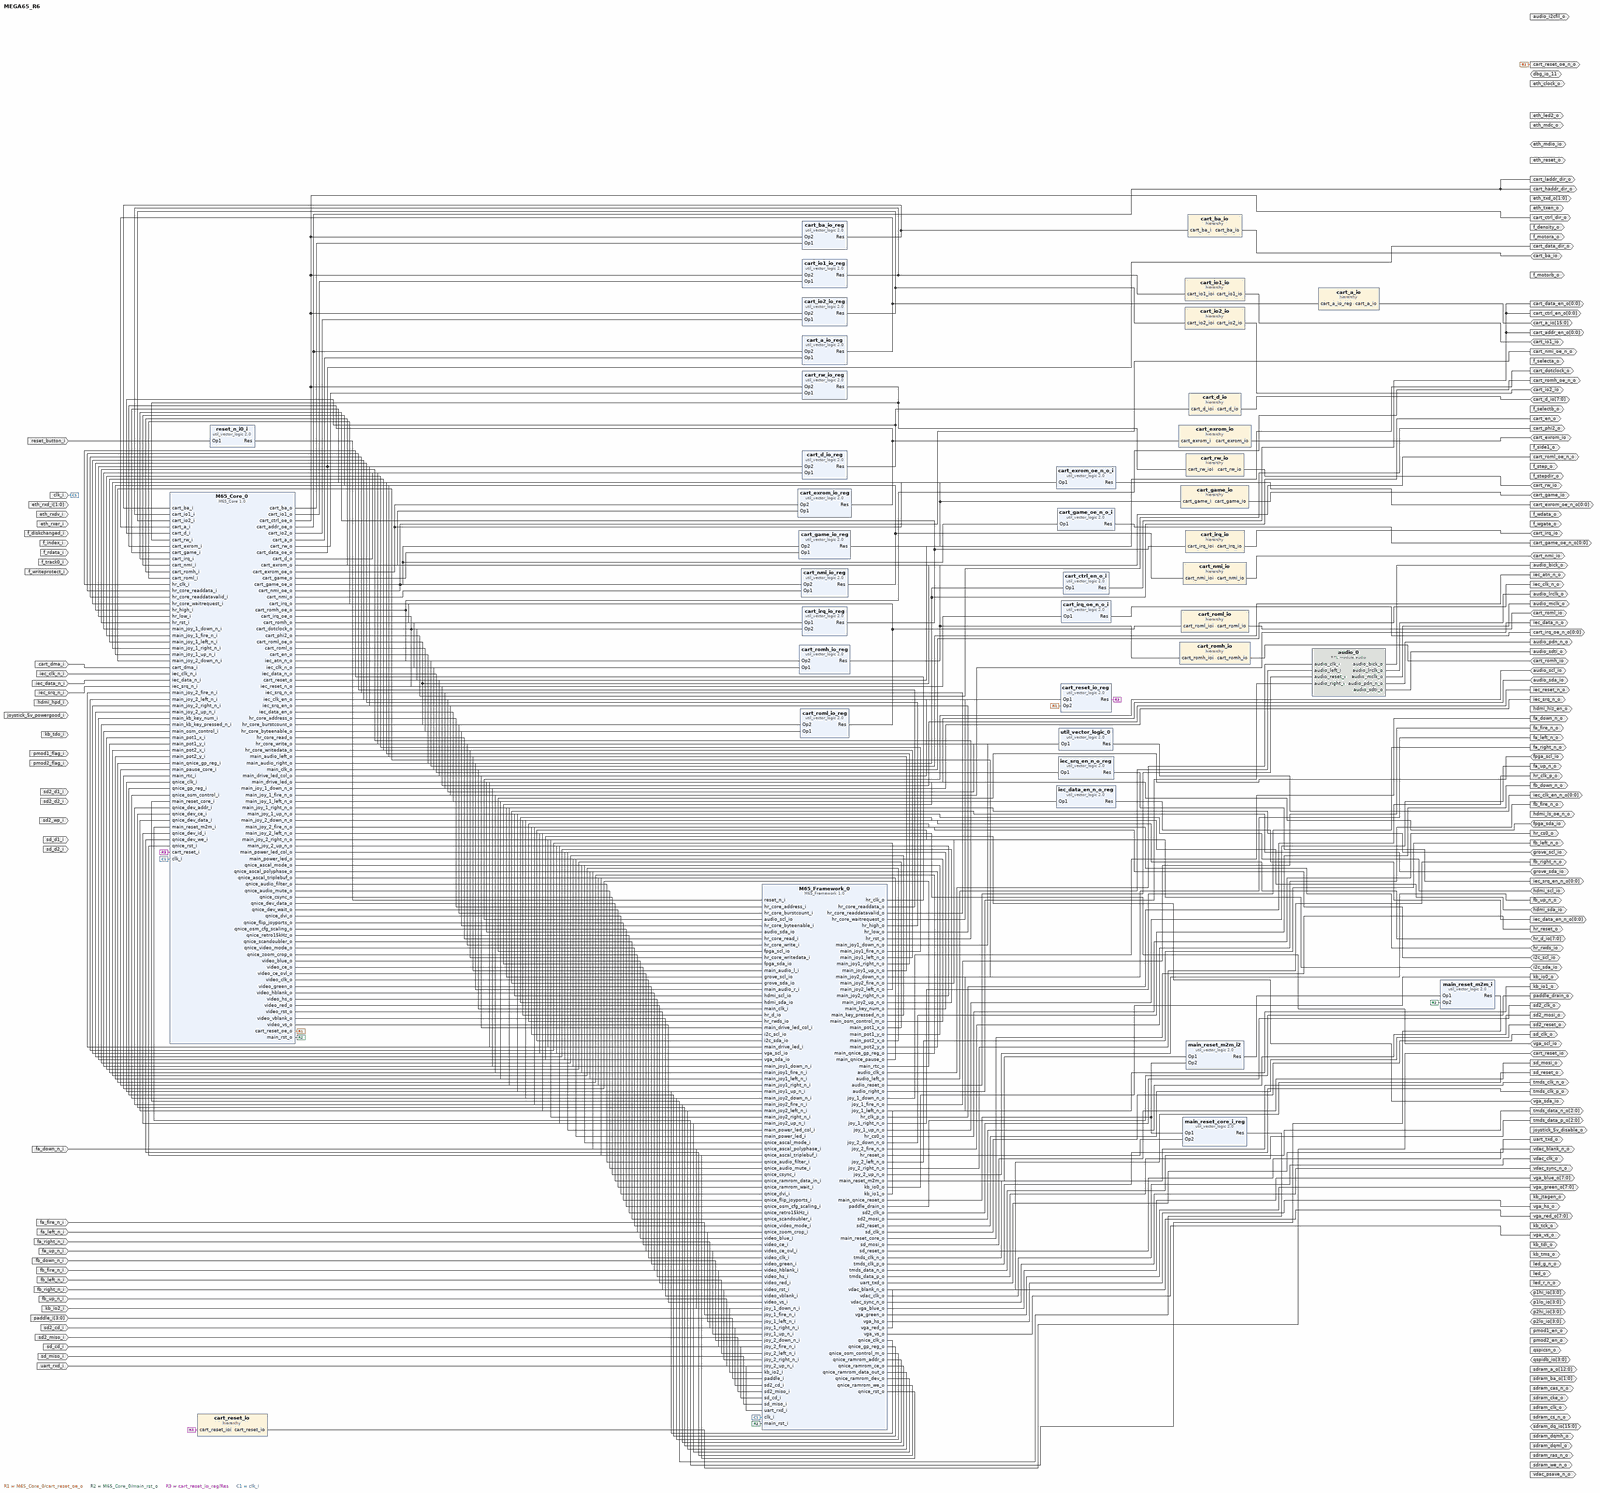
[diagram p0: block diagram of the top level, whole]
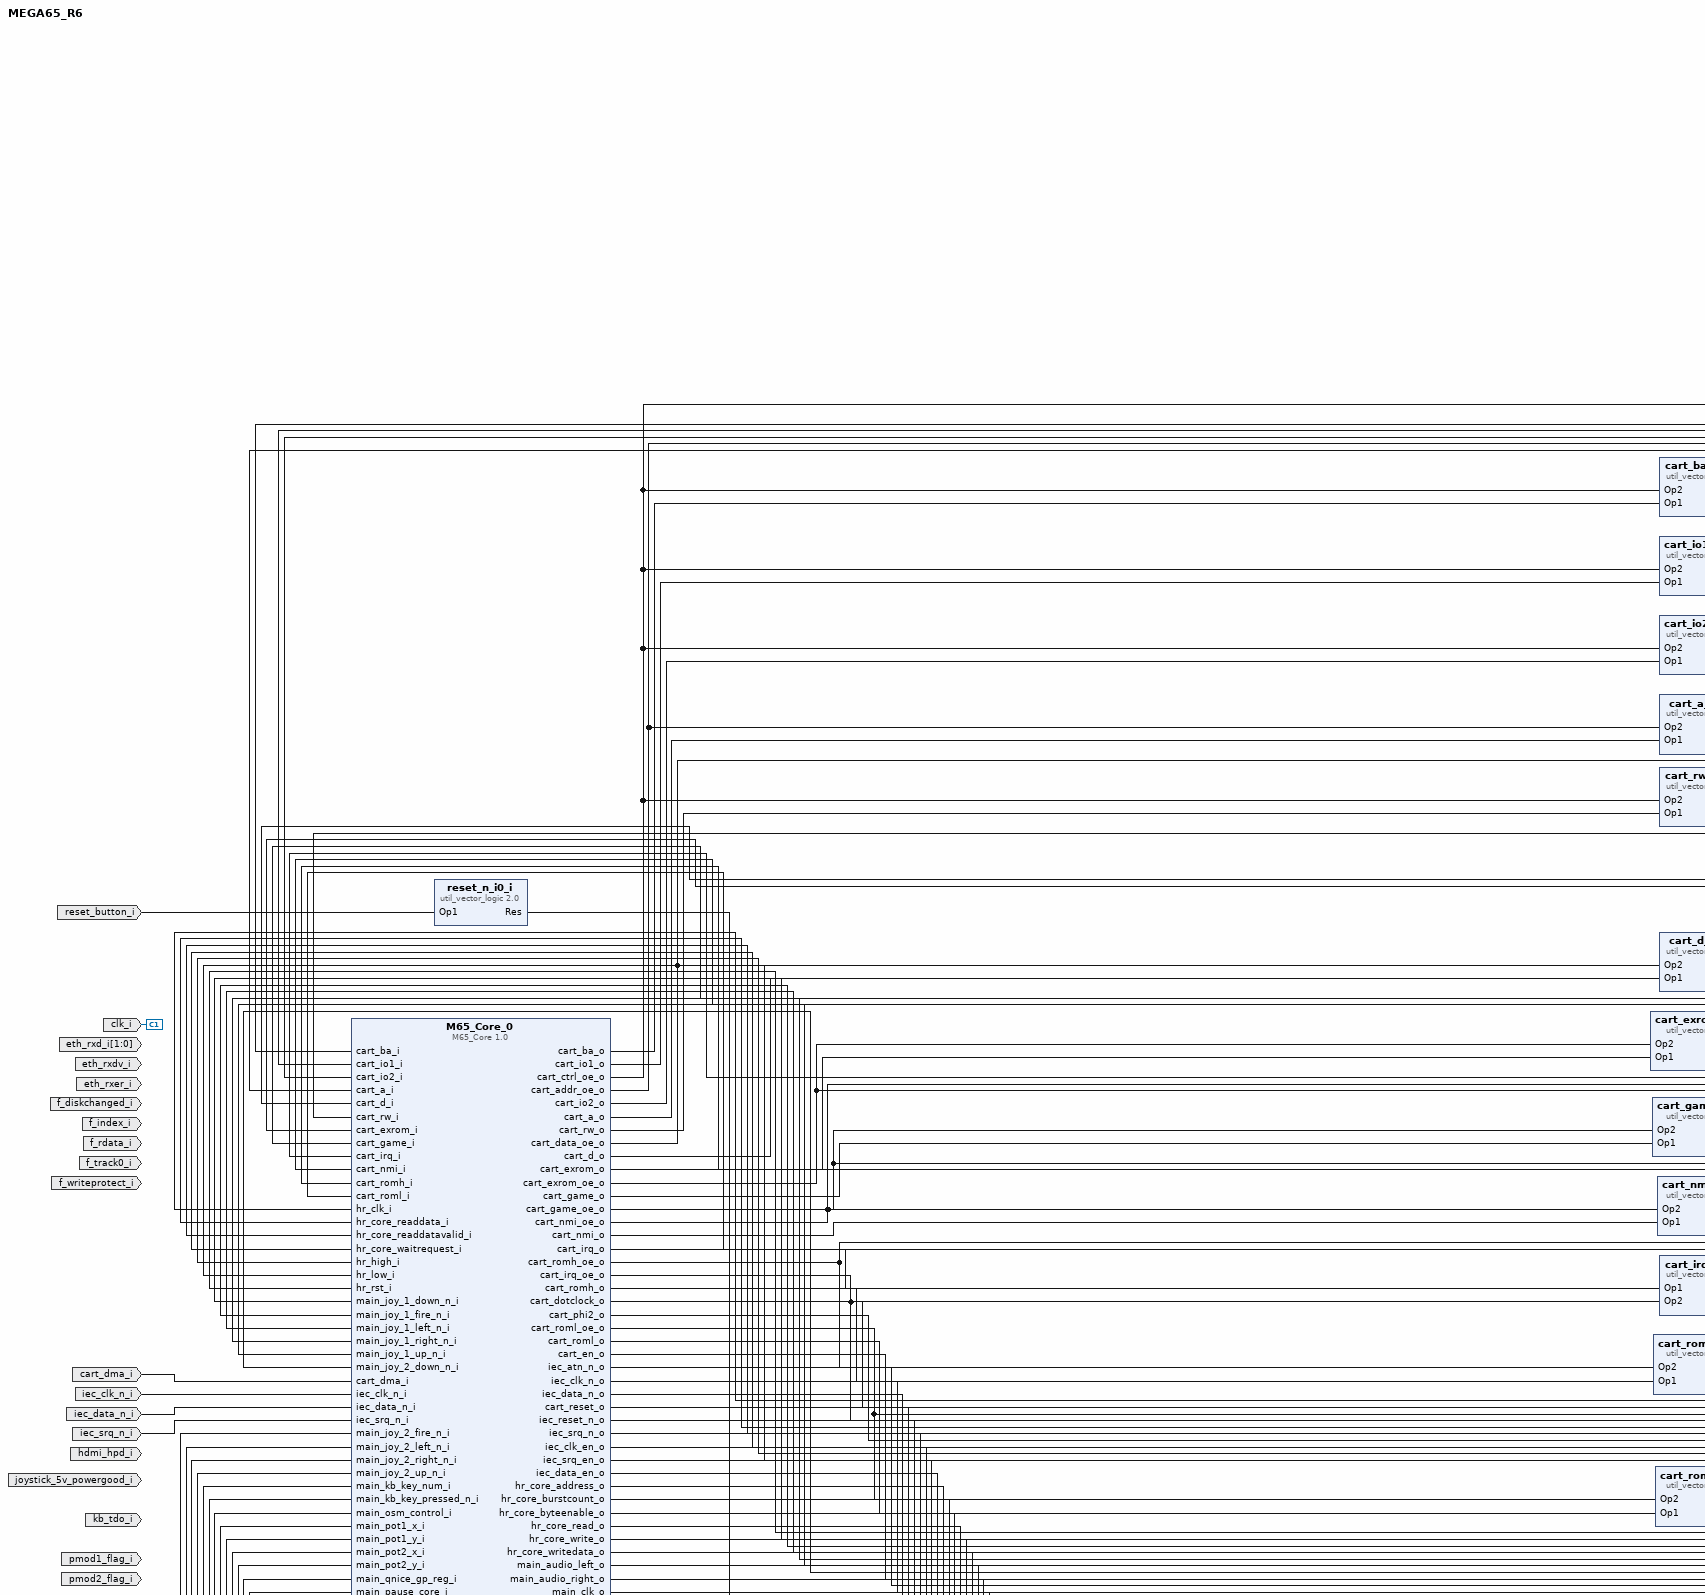
[diagram p1: block diagram of the top level, upper left part]
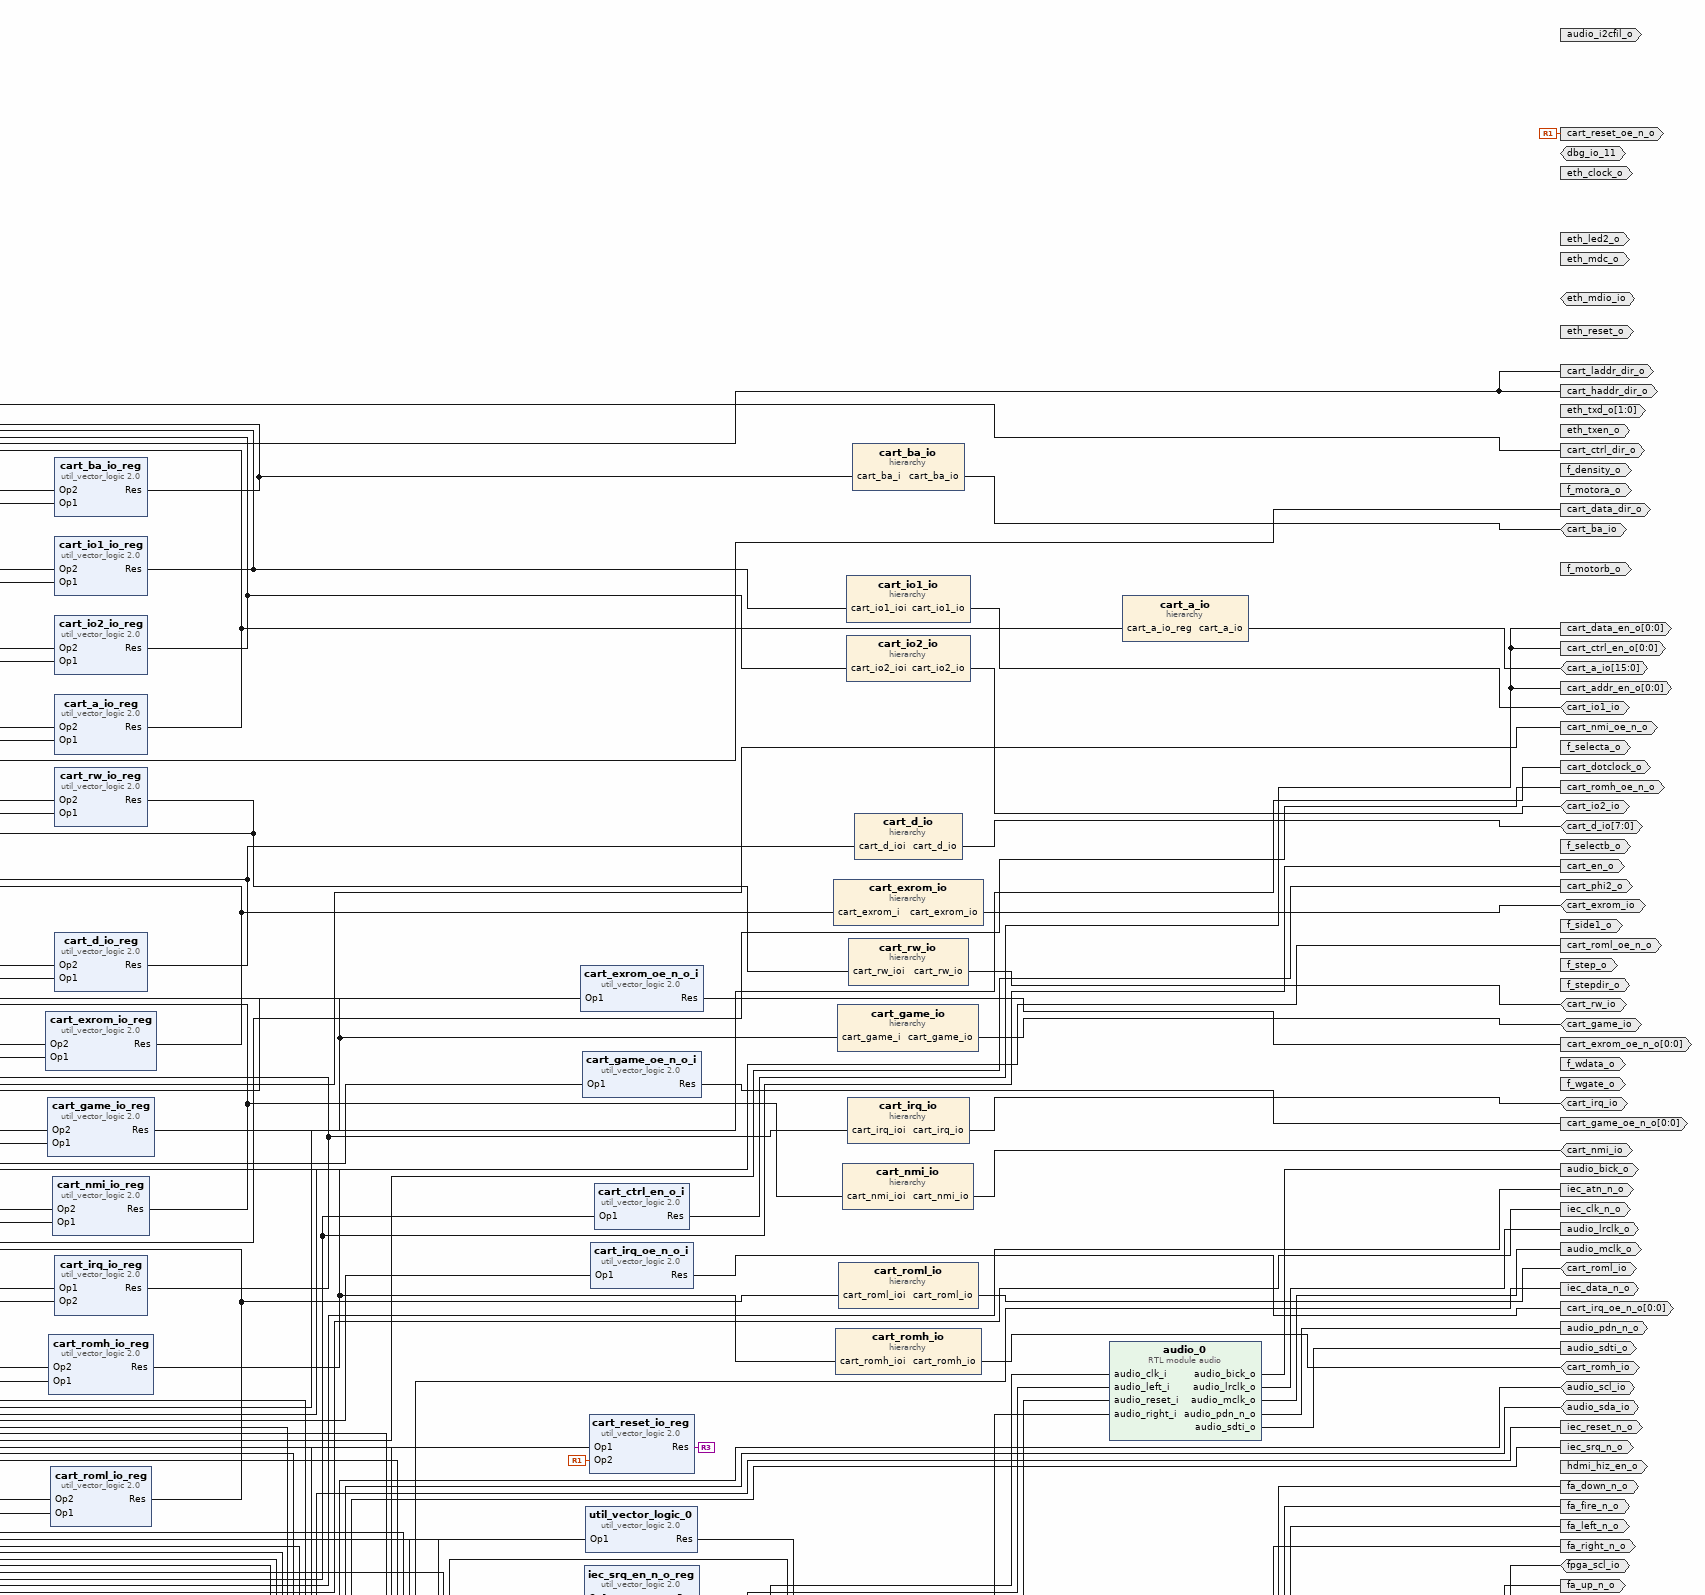
[diagram p2: block diagram of the top level, upper right part]
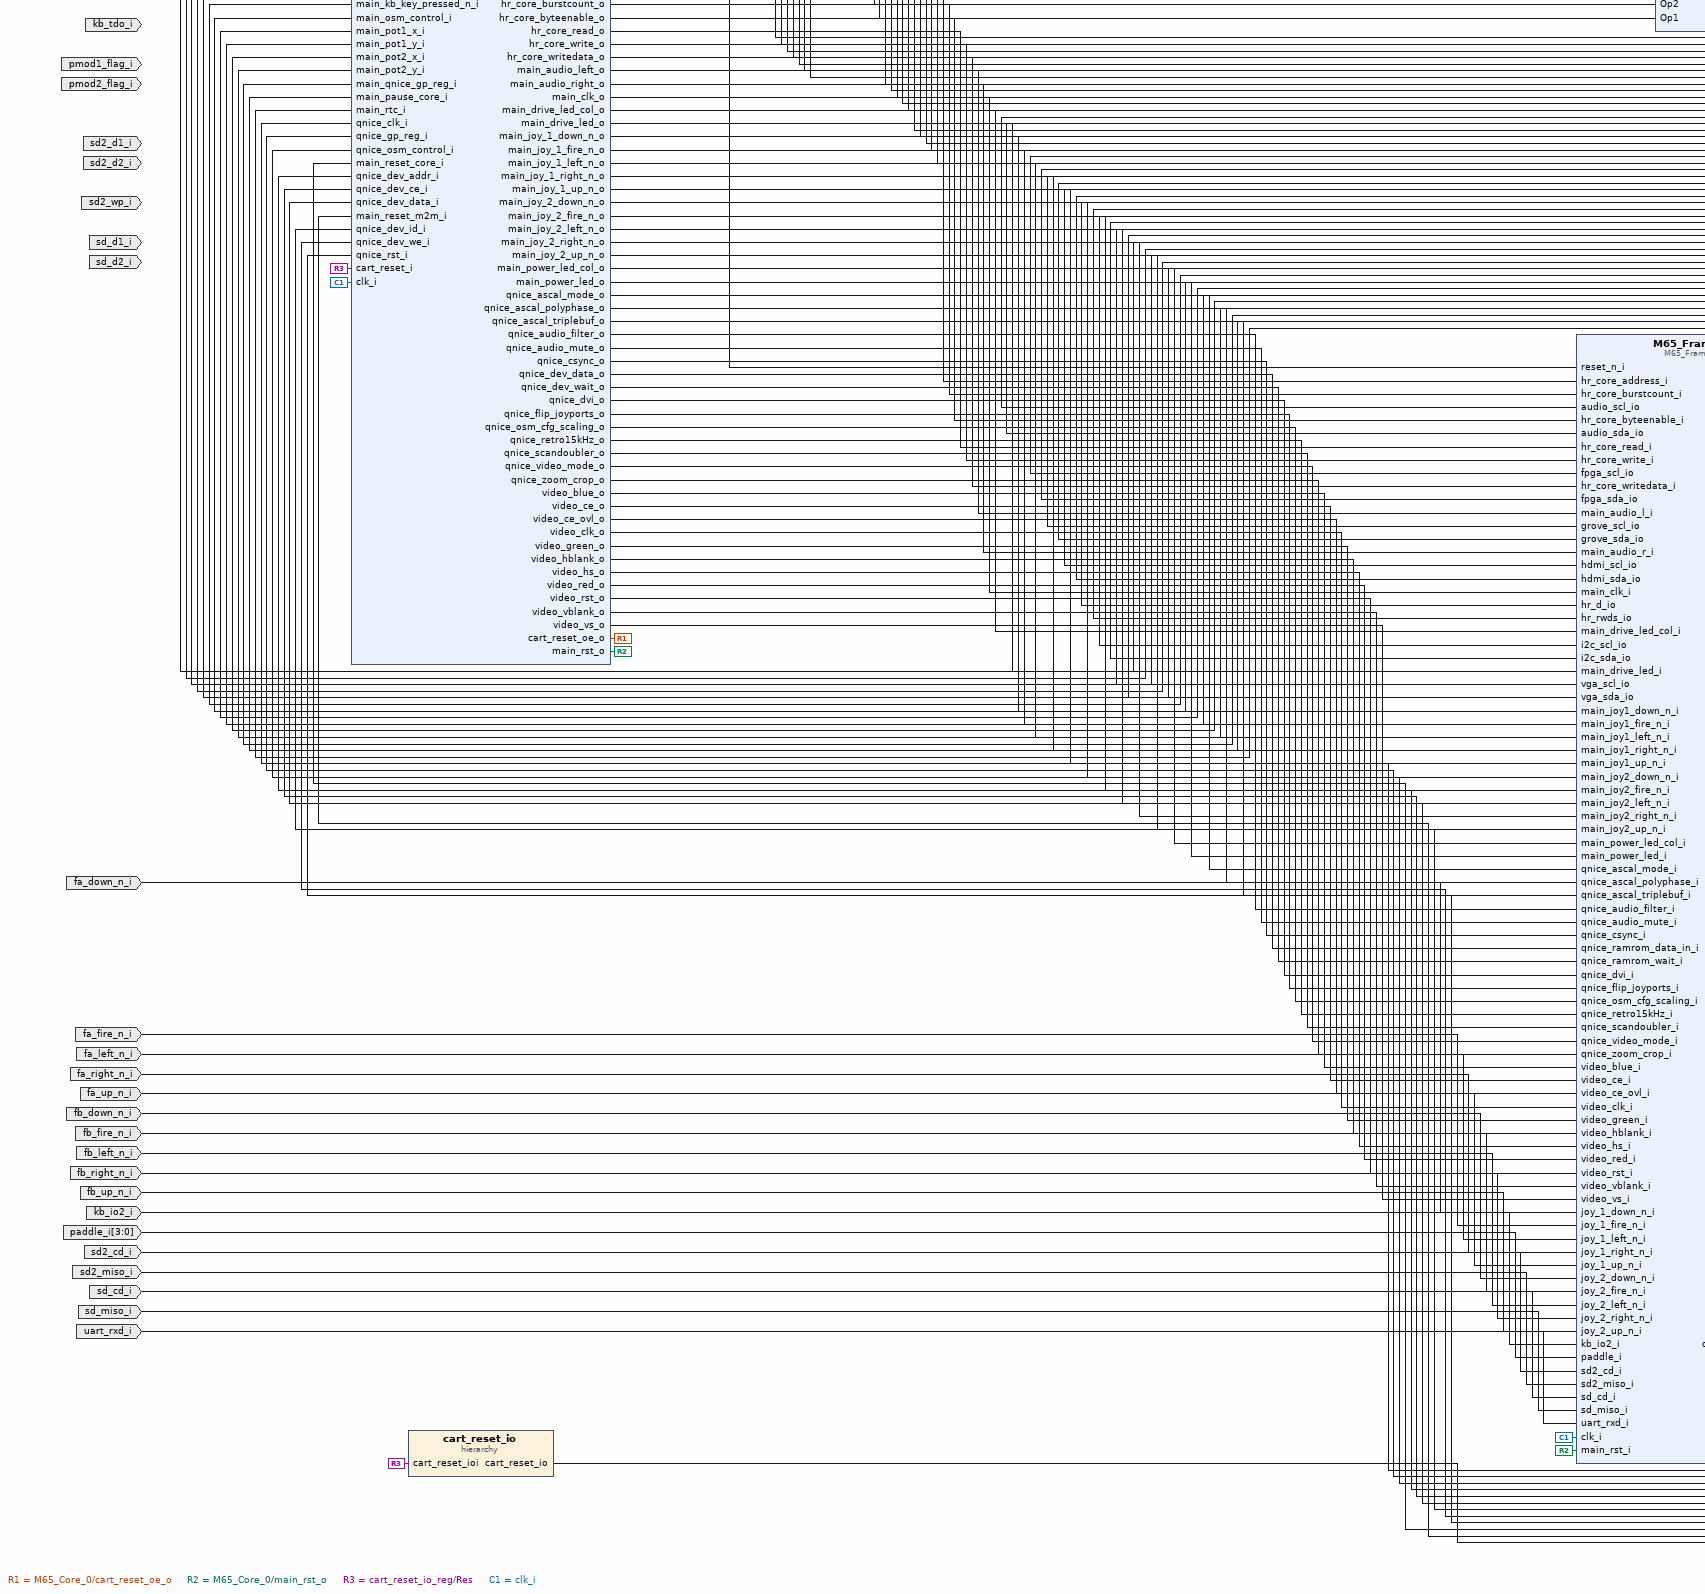
[diagram p3: block diagram of the top level, lower left part]
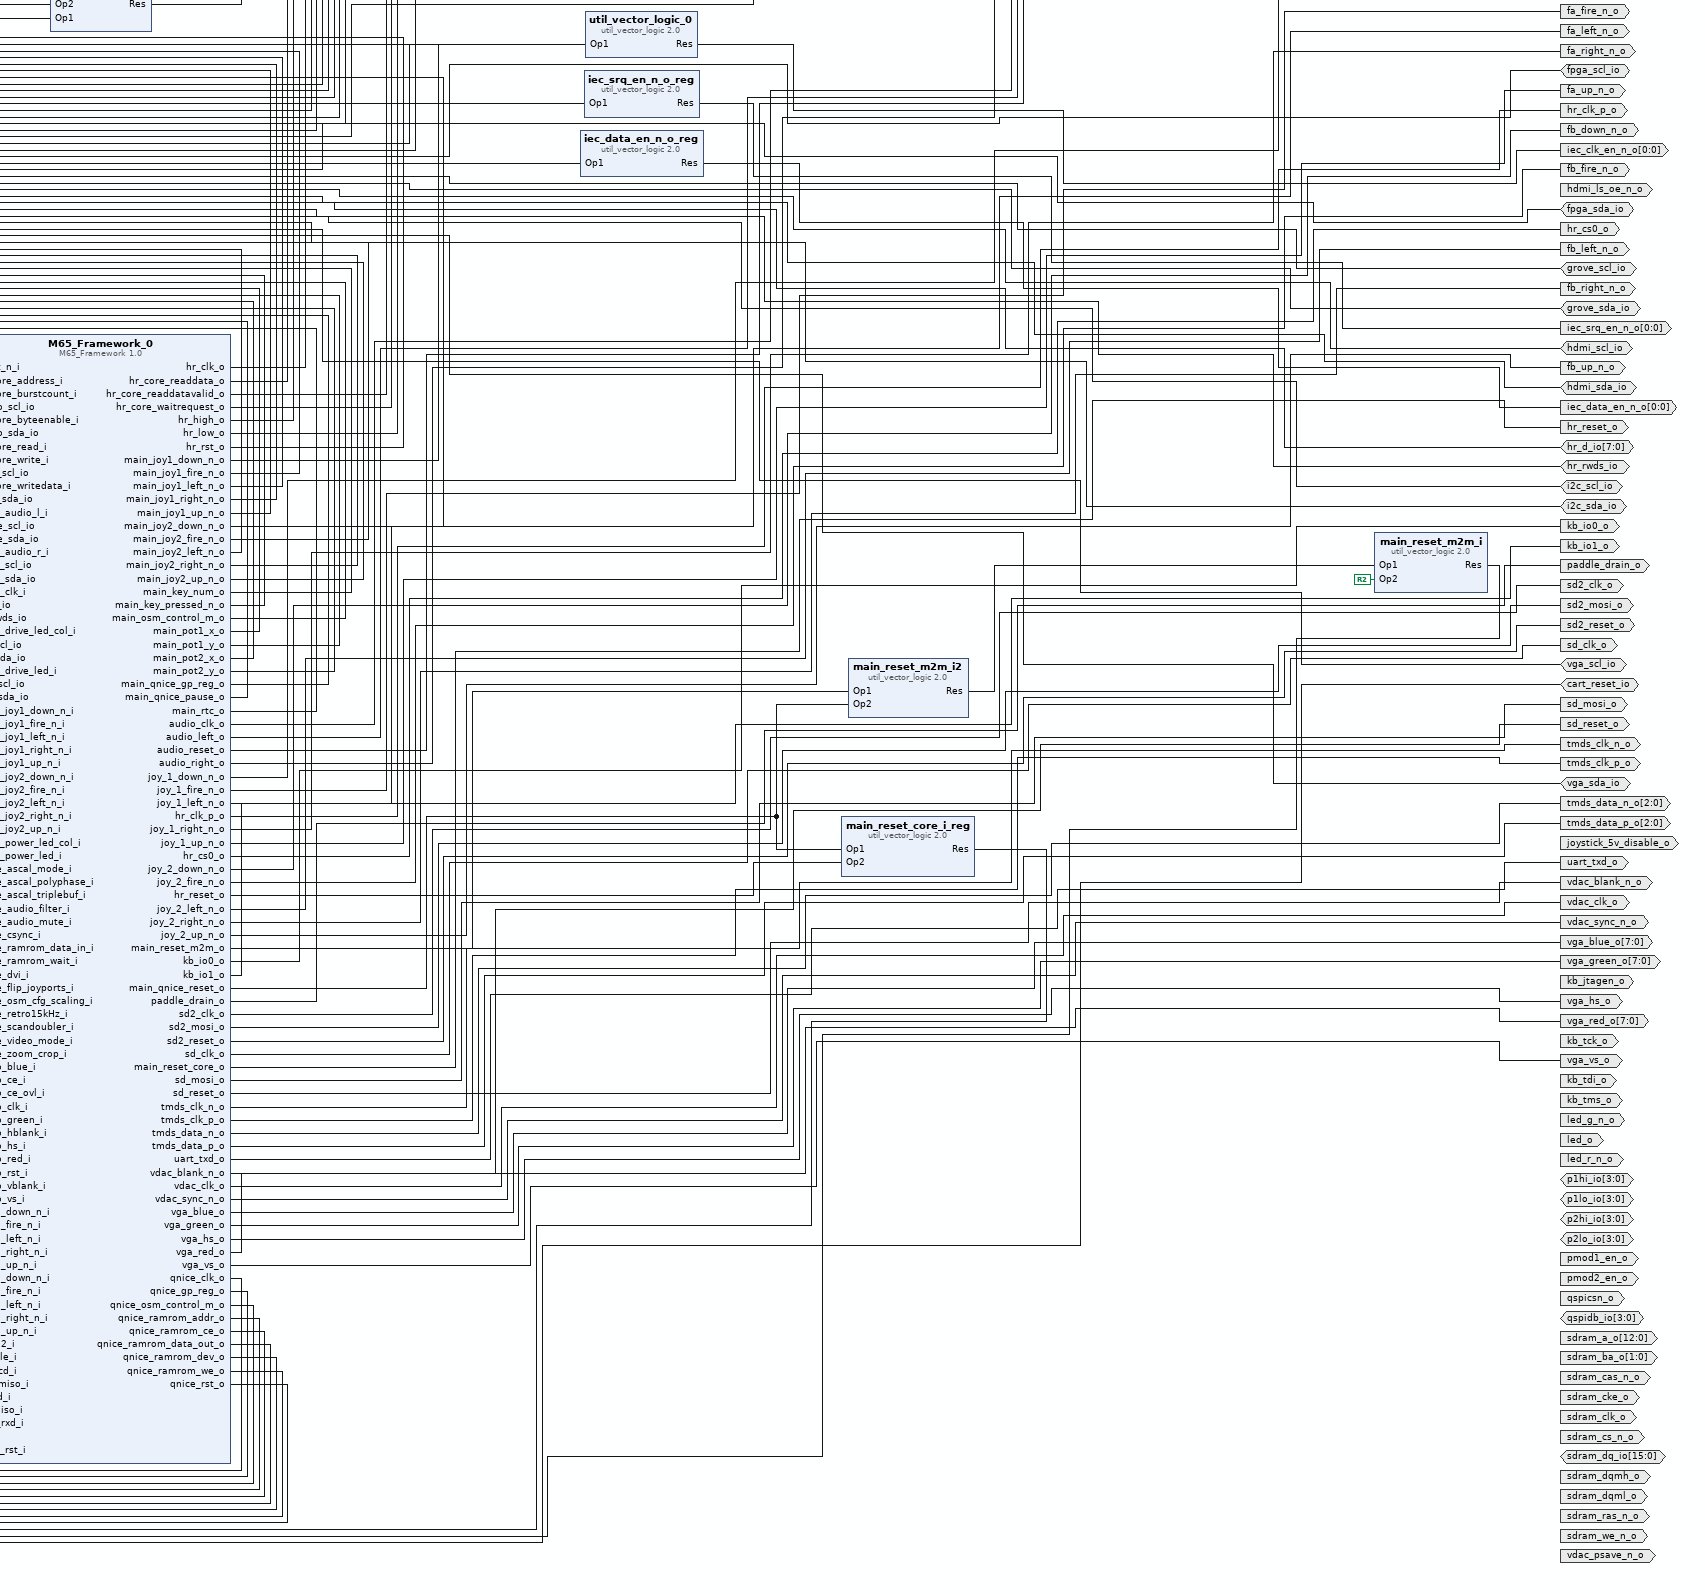
[diagram p4: block diagram of the top level, lower right part]
# Vivado block design MEGA65_R6, xc7a200tfbg484-3, Vivado 2024.2.1
create_bd_design MEGA65_R6

create_bd_port -dir I -type clk clk_i
set_property -dict {CONFIG.FREQ_HZ 100000000} [get_bd_ports clk_i]
create_bd_port -dir I -type rst reset_button_i
set_property -dict {CONFIG.POLARITY ACTIVE_HIGH} [get_bd_ports reset_button_i]
create_bd_port -dir I uart_rxd_i
create_bd_port -dir O uart_txd_o
create_bd_port -dir O -from 7 -to 0 vga_red_o
create_bd_port -dir O -from 7 -to 0 vga_green_o
create_bd_port -dir O -from 7 -to 0 vga_blue_o
create_bd_port -dir O vga_hs_o
create_bd_port -dir O vga_vs_o
create_bd_port -dir IO vga_scl_io
create_bd_port -dir IO vga_sda_io
create_bd_port -dir O -type clk vdac_clk_o
create_bd_port -dir O vdac_sync_n_o
create_bd_port -dir O vdac_blank_n_o
create_bd_port -dir O vdac_psave_n_o
create_bd_port -dir O -from 2 -to 0 tmds_data_p_o
create_bd_port -dir O -from 2 -to 0 tmds_data_n_o
create_bd_port -dir O -type clk tmds_clk_p_o
create_bd_port -dir O -type clk tmds_clk_n_o
create_bd_port -dir O hdmi_hiz_en_o
create_bd_port -dir O hdmi_ls_oe_n_o
create_bd_port -dir I hdmi_hpd_i
create_bd_port -dir IO hdmi_scl_io
create_bd_port -dir IO hdmi_sda_io
create_bd_port -dir O kb_io0_o
create_bd_port -dir O kb_io1_o
create_bd_port -dir I kb_io2_i
create_bd_port -dir O kb_tck_o
create_bd_port -dir I kb_tdo_i
create_bd_port -dir O kb_tms_o
create_bd_port -dir O kb_tdi_o
create_bd_port -dir O kb_jtagen_o
create_bd_port -dir O sd_reset_o
create_bd_port -dir O -type clk sd_clk_o
create_bd_port -dir O sd_mosi_o
create_bd_port -dir I sd_miso_i
create_bd_port -dir I sd_cd_i
create_bd_port -dir I sd_d1_i
create_bd_port -dir I sd_d2_i
create_bd_port -dir O sd2_reset_o
create_bd_port -dir O -type clk sd2_clk_o
create_bd_port -dir O sd2_mosi_o
create_bd_port -dir I sd2_miso_i
create_bd_port -dir I sd2_cd_i
create_bd_port -dir I sd2_wp_i
create_bd_port -dir I sd2_d1_i
create_bd_port -dir I sd2_d2_i
create_bd_port -dir O -type clk audio_mclk_o
set_property -dict {CONFIG.FREQ_HZ 12288000} [get_bd_ports audio_mclk_o]
create_bd_port -dir O -type clk audio_bick_o
set_property -dict {CONFIG.FREQ_HZ 3072000} [get_bd_ports audio_bick_o]
create_bd_port -dir O -type data audio_sdti_o
create_bd_port -dir O -type clk audio_lrclk_o
set_property -dict {CONFIG.FREQ_HZ 48000000} [get_bd_ports audio_lrclk_o]
create_bd_port -dir O -type rst audio_pdn_n_o
create_bd_port -dir O audio_i2cfil_o
create_bd_port -dir IO -type data audio_scl_io
create_bd_port -dir IO audio_sda_io
create_bd_port -dir I fa_up_n_i
create_bd_port -dir I fa_down_n_i
create_bd_port -dir I fa_left_n_i
create_bd_port -dir I fa_right_n_i
create_bd_port -dir I fa_fire_n_i
create_bd_port -dir O fa_fire_n_o
create_bd_port -dir O fa_up_n_o
create_bd_port -dir O fa_left_n_o
create_bd_port -dir O fa_down_n_o
create_bd_port -dir O fa_right_n_o
create_bd_port -dir I fb_up_n_i
create_bd_port -dir I fb_down_n_i
create_bd_port -dir I fb_left_n_i
create_bd_port -dir I fb_right_n_i
create_bd_port -dir I fb_fire_n_i
create_bd_port -dir O fb_up_n_o
create_bd_port -dir O fb_down_n_o
create_bd_port -dir O fb_fire_n_o
create_bd_port -dir O fb_right_n_o
create_bd_port -dir O fb_left_n_o
create_bd_port -dir O joystick_5v_disable_o
create_bd_port -dir I joystick_5v_powergood_i
create_bd_port -dir I -from 3 -to 0 paddle_i
create_bd_port -dir O paddle_drain_o
create_bd_port -dir IO -from 7 -to 0 hr_d_io
create_bd_port -dir IO hr_rwds_io
create_bd_port -dir O -type rst hr_reset_o
create_bd_port -dir O -type clk hr_clk_p_o
create_bd_port -dir O hr_cs0_o
create_bd_port -dir O -type rst iec_reset_n_o
create_bd_port -dir O iec_atn_n_o
create_bd_port -dir O -from 0 -to 0 -type clk iec_clk_en_n_o
create_bd_port -dir I -type clk iec_clk_n_i
set_property -dict {CONFIG.FREQ_HZ 100000000} [get_bd_ports iec_clk_n_i]
create_bd_port -dir O -type clk iec_clk_n_o
create_bd_port -dir O -from 0 -to 0 iec_data_en_n_o
create_bd_port -dir I -type data iec_data_n_i
create_bd_port -dir O -type data iec_data_n_o
create_bd_port -dir O -from 0 -to 0 iec_srq_en_n_o
create_bd_port -dir I iec_srq_n_i
create_bd_port -dir O iec_srq_n_o
create_bd_port -dir O cart_phi2_o
create_bd_port -dir O -type clk cart_dotclock_o
create_bd_port -dir I cart_dma_i
create_bd_port -dir O -type rst cart_reset_oe_n_o
create_bd_port -dir IO -type rst cart_reset_io
create_bd_port -dir O -from 0 -to 0 cart_game_oe_n_o
create_bd_port -dir IO cart_game_io
create_bd_port -dir O -from 0 -to 0 cart_exrom_oe_n_o
create_bd_port -dir IO cart_exrom_io
create_bd_port -dir O cart_nmi_oe_n_o
create_bd_port -dir IO cart_nmi_io
create_bd_port -dir O -from 0 -to 0 cart_irq_oe_n_o
create_bd_port -dir IO cart_irq_io
create_bd_port -dir O -from 0 -to 0 cart_ctrl_en_o
create_bd_port -dir O cart_ctrl_dir_o
create_bd_port -dir IO cart_ba_io
create_bd_port -dir IO cart_rw_io
create_bd_port -dir IO cart_io1_io
create_bd_port -dir IO cart_io2_io
create_bd_port -dir O cart_romh_oe_n_o
create_bd_port -dir IO cart_romh_io
create_bd_port -dir O cart_roml_oe_n_o
create_bd_port -dir IO cart_roml_io
create_bd_port -dir O cart_en_o
create_bd_port -dir O -from 0 -to 0 cart_addr_en_o
create_bd_port -dir O cart_haddr_dir_o
create_bd_port -dir O cart_laddr_dir_o
create_bd_port -dir IO -from 15 -to 0 cart_a_io
create_bd_port -dir O -from 0 -to 0 cart_data_en_o
create_bd_port -dir O cart_data_dir_o
create_bd_port -dir IO -from 7 -to 0 cart_d_io
create_bd_port -dir O -type clk eth_clock_o
create_bd_port -dir O eth_led2_o
create_bd_port -dir O eth_mdc_o
create_bd_port -dir IO eth_mdio_io
create_bd_port -dir O -type rst eth_reset_o
create_bd_port -dir I -from 1 -to 0 eth_rxd_i
create_bd_port -dir I eth_rxdv_i
create_bd_port -dir I eth_rxer_i
create_bd_port -dir O -from 1 -to 0 eth_txd_o
create_bd_port -dir O eth_txen_o
create_bd_port -dir O f_density_o
create_bd_port -dir I f_diskchanged_i
create_bd_port -dir I f_index_i
create_bd_port -dir O f_motora_o
create_bd_port -dir O f_motorb_o
create_bd_port -dir I f_rdata_i
create_bd_port -dir O f_selecta_o
create_bd_port -dir O f_selectb_o
create_bd_port -dir O f_side1_o
create_bd_port -dir O f_stepdir_o
create_bd_port -dir O f_step_o
create_bd_port -dir I f_track0_i
create_bd_port -dir O f_wdata_o
create_bd_port -dir O f_wgate_o
create_bd_port -dir I f_writeprotect_i
create_bd_port -dir IO fpga_sda_io
create_bd_port -dir IO fpga_scl_io
create_bd_port -dir IO grove_sda_io
create_bd_port -dir IO grove_scl_io
create_bd_port -dir O led_g_n_o
create_bd_port -dir O led_r_n_o
create_bd_port -dir O led_o
create_bd_port -dir IO -from 3 -to 0 p1lo_io
create_bd_port -dir IO -from 3 -to 0 p1hi_io
create_bd_port -dir IO -from 3 -to 0 p2lo_io
create_bd_port -dir IO -from 3 -to 0 p2hi_io
create_bd_port -dir O pmod1_en_o
create_bd_port -dir I pmod1_flag_i
create_bd_port -dir O pmod2_en_o
create_bd_port -dir I pmod2_flag_i
create_bd_port -dir IO -from 3 -to 0 qspidb_io
create_bd_port -dir O qspicsn_o
create_bd_port -dir IO i2c_scl_io
create_bd_port -dir IO i2c_sda_io
create_bd_port -dir IO dbg_io_11
create_bd_port -dir O -type clk sdram_clk_o
create_bd_port -dir O sdram_cke_o
create_bd_port -dir O sdram_ras_n_o
create_bd_port -dir O sdram_cas_n_o
create_bd_port -dir O sdram_we_n_o
create_bd_port -dir O sdram_cs_n_o
create_bd_port -dir O -from 1 -to 0 sdram_ba_o
create_bd_port -dir O -from 12 -to 0 sdram_a_o
create_bd_port -dir O sdram_dqml_o
create_bd_port -dir O sdram_dqmh_o
create_bd_port -dir IO -from 15 -to 0 sdram_dq_io

create_bd_cell -type module -reference audio audio_0
create_bd_cell -type ip -vlnv xilinx.com:user:M65_Core:1.0 M65_Core_0
create_bd_cell -type ip -vlnv xilinx.com:user:M65_Framework:1.0 M65_Framework_0
create_bd_cell -type ip -vlnv xilinx.com:ip:util_vector_logic:2.0 util_vector_logic_0
set_property -dict {CONFIG.C_OPERATION not CONFIG.C_SIZE 1} [get_bd_cells util_vector_logic_0]
create_bd_cell -type hier cart_a_io
create_bd_cell -type ip -vlnv xilinx.com:ip:util_vector_logic:2.0 cart_a_io_reg
set_property -dict {CONFIG.C_SIZE 1} [get_bd_cells cart_a_io_reg]
create_bd_cell -type hier cart_ba_io
create_bd_cell -type ip -vlnv xilinx.com:ip:util_vector_logic:2.0 cart_ba_io_reg
set_property -dict {CONFIG.C_SIZE 1} [get_bd_cells cart_ba_io_reg]
create_bd_cell -type hier cart_exrom_io
create_bd_cell -type ip -vlnv xilinx.com:ip:util_vector_logic:2.0 cart_exrom_io_reg
set_property -dict {CONFIG.C_SIZE 1} [get_bd_cells cart_exrom_io_reg]
create_bd_cell -type ip -vlnv xilinx.com:ip:util_vector_logic:2.0 cart_exrom_oe_n_o_i
set_property -dict {CONFIG.C_OPERATION not CONFIG.C_SIZE 1} [get_bd_cells cart_exrom_oe_n_o_i]
create_bd_cell -type hier cart_game_io
create_bd_cell -type ip -vlnv xilinx.com:ip:util_vector_logic:2.0 cart_game_io_reg
set_property -dict {CONFIG.C_SIZE 1} [get_bd_cells cart_game_io_reg]
create_bd_cell -type ip -vlnv xilinx.com:ip:util_vector_logic:2.0 cart_game_oe_n_o_i
set_property -dict {CONFIG.C_OPERATION not CONFIG.C_SIZE 1} [get_bd_cells cart_game_oe_n_o_i]
create_bd_cell -type hier cart_io1_io
create_bd_cell -type ip -vlnv xilinx.com:ip:util_vector_logic:2.0 cart_io1_io_reg
set_property -dict {CONFIG.C_SIZE 1} [get_bd_cells cart_io1_io_reg]
create_bd_cell -type hier cart_io2_io
create_bd_cell -type ip -vlnv xilinx.com:ip:util_vector_logic:2.0 cart_io2_io_reg
set_property -dict {CONFIG.C_SIZE 1} [get_bd_cells cart_io2_io_reg]
create_bd_cell -type hier cart_irq_io
create_bd_cell -type ip -vlnv xilinx.com:ip:util_vector_logic:2.0 cart_irq_io_reg
set_property -dict {CONFIG.C_SIZE 1} [get_bd_cells cart_irq_io_reg]
create_bd_cell -type ip -vlnv xilinx.com:ip:util_vector_logic:2.0 cart_irq_oe_n_o_i
set_property -dict {CONFIG.C_OPERATION not CONFIG.C_SIZE 1} [get_bd_cells cart_irq_oe_n_o_i]
create_bd_cell -type hier cart_nmi_io
create_bd_cell -type ip -vlnv xilinx.com:ip:util_vector_logic:2.0 cart_nmi_io_reg
create_bd_cell -type hier cart_reset_io
create_bd_cell -type ip -vlnv xilinx.com:ip:util_vector_logic:2.0 cart_reset_io_reg
set_property -dict {CONFIG.C_SIZE 1} [get_bd_cells cart_reset_io_reg]
create_bd_cell -type hier cart_romh_io
create_bd_cell -type ip -vlnv xilinx.com:ip:util_vector_logic:2.0 cart_romh_io_reg
set_property -dict {CONFIG.C_SIZE 1} [get_bd_cells cart_romh_io_reg]
create_bd_cell -type hier cart_roml_io
create_bd_cell -type ip -vlnv xilinx.com:ip:util_vector_logic:2.0 cart_roml_io_reg
create_bd_cell -type hier cart_rw_io
create_bd_cell -type ip -vlnv xilinx.com:ip:util_vector_logic:2.0 cart_rw_io_reg
create_bd_cell -type hier cart_d_io
create_bd_cell -type ip -vlnv xilinx.com:ip:util_vector_logic:2.0 cart_d_io_reg
create_bd_cell -type ip -vlnv xilinx.com:ip:util_vector_logic:2.0 cart_ctrl_en_o_i
set_property -dict {CONFIG.C_OPERATION not CONFIG.C_SIZE 1} [get_bd_cells cart_ctrl_en_o_i]
create_bd_cell -type ip -vlnv xilinx.com:ip:util_vector_logic:2.0 main_reset_core_i_reg
set_property -dict {CONFIG.C_SIZE 1} [get_bd_cells main_reset_core_i_reg]
create_bd_cell -type ip -vlnv xilinx.com:ip:util_vector_logic:2.0 main_reset_m2m_i
set_property -dict {CONFIG.C_SIZE 1} [get_bd_cells main_reset_m2m_i]
create_bd_cell -type ip -vlnv xilinx.com:ip:util_vector_logic:2.0 main_reset_m2m_i2
set_property -dict {CONFIG.C_SIZE 1} [get_bd_cells main_reset_m2m_i2]
create_bd_cell -type ip -vlnv xilinx.com:ip:util_vector_logic:2.0 iec_data_en_n_o_reg
set_property -dict {CONFIG.C_OPERATION not CONFIG.C_SIZE 1} [get_bd_cells iec_data_en_n_o_reg]
create_bd_cell -type ip -vlnv xilinx.com:ip:util_vector_logic:2.0 iec_srq_en_n_o_reg
set_property -dict {CONFIG.C_OPERATION not CONFIG.C_SIZE 1} [get_bd_cells iec_srq_en_n_o_reg]
create_bd_cell -type ip -vlnv xilinx.com:ip:util_vector_logic:2.0 reset_n_i0_i
set_property -dict {CONFIG.C_OPERATION not CONFIG.C_SIZE 1} [get_bd_cells reset_n_i0_i]

# ---- hierarchy /cart_a_io ----
current_bd_instance /cart_a_io
create_bd_pin -dir IO -from 15 -to 0 cart_a_io
create_bd_pin -dir I -from 0 -to 0 cart_a_io_reg

# ---- hierarchy /cart_ba_io ----
current_bd_instance /cart_ba_io
create_bd_pin -dir IO cart_ba_io
create_bd_pin -dir I cart_ba_i

# ---- hierarchy /cart_exrom_io ----
current_bd_instance /cart_exrom_io
create_bd_pin -dir IO cart_exrom_io
create_bd_pin -dir I cart_exrom_i

# ---- hierarchy /cart_game_io ----
current_bd_instance /cart_game_io
create_bd_pin -dir IO cart_game_io
create_bd_pin -dir I cart_game_i

# ---- hierarchy /cart_io1_io ----
current_bd_instance /cart_io1_io
create_bd_pin -dir IO cart_io1_io
create_bd_pin -dir I cart_io1_ioi

# ---- hierarchy /cart_io2_io ----
current_bd_instance /cart_io2_io
create_bd_pin -dir IO cart_io2_io
create_bd_pin -dir I cart_io2_ioi

# ---- hierarchy /cart_irq_io ----
current_bd_instance /cart_irq_io
create_bd_pin -dir IO cart_irq_io
create_bd_pin -dir I cart_irq_ioi

# ---- hierarchy /cart_nmi_io ----
current_bd_instance /cart_nmi_io
create_bd_pin -dir IO cart_nmi_io
create_bd_pin -dir I -from 7 -to 0 cart_nmi_ioi

# ---- hierarchy /cart_reset_io ----
current_bd_instance /cart_reset_io
create_bd_pin -dir IO cart_reset_io
create_bd_pin -dir I cart_reset_ioi

# ---- hierarchy /cart_romh_io ----
current_bd_instance /cart_romh_io
create_bd_pin -dir IO cart_romh_io
create_bd_pin -dir I cart_romh_ioi

# ---- hierarchy /cart_roml_io ----
current_bd_instance /cart_roml_io
create_bd_pin -dir IO cart_roml_io
create_bd_pin -dir I -from 7 -to 0 cart_roml_ioi

# ---- hierarchy /cart_rw_io ----
current_bd_instance /cart_rw_io
create_bd_pin -dir IO cart_rw_io
create_bd_pin -dir I -from 7 -to 0 cart_rw_ioi

# ---- hierarchy /cart_d_io ----
current_bd_instance /cart_d_io
create_bd_pin -dir IO cart_d_io
create_bd_pin -dir I -from 7 -to 0 cart_d_ioi

# ---- connections ----

current_bd_instance /
connect_bd_net [get_bd_pins M65_Core_0/cart_a_o] [get_bd_pins cart_a_io_reg/Op1]
connect_bd_net [get_bd_pins M65_Core_0/cart_addr_oe_o] [get_bd_pins cart_a_io_reg/Op2] [get_bd_ports cart_haddr_dir_o] [get_bd_ports cart_laddr_dir_o]
connect_bd_net [get_bd_pins M65_Core_0/cart_ba_o] [get_bd_pins cart_ba_io_reg/Op1]
connect_bd_net [get_bd_pins M65_Core_0/cart_ctrl_oe_o] \
  [get_bd_pins cart_ba_io_reg/Op2] [get_bd_ports cart_ctrl_dir_o] [get_bd_pins cart_io1_io_reg/Op2] \
  [get_bd_pins cart_io2_io_reg/Op2] [get_bd_pins cart_rw_io_reg/Op2]
connect_bd_net [get_bd_pins M65_Core_0/cart_d_o] [get_bd_pins cart_d_io_reg/Op1]
connect_bd_net [get_bd_pins M65_Core_0/cart_data_oe_o] [get_bd_pins cart_d_io_reg/Op2] [get_bd_ports cart_data_dir_o]
connect_bd_net [get_bd_pins M65_Core_0/cart_dotclock_o] [get_bd_ports cart_dotclock_o]
connect_bd_net [get_bd_pins M65_Core_0/cart_en_o] [get_bd_ports cart_en_o] [get_bd_pins cart_ctrl_en_o_i/Op1]
connect_bd_net [get_bd_pins M65_Core_0/cart_exrom_o] [get_bd_pins cart_exrom_io_reg/Op1]
connect_bd_net [get_bd_pins M65_Core_0/cart_exrom_oe_o] [get_bd_pins cart_exrom_io_reg/Op2] [get_bd_pins cart_exrom_oe_n_o_i/Op1]
connect_bd_net [get_bd_pins M65_Core_0/cart_game_o] [get_bd_pins cart_game_io_reg/Op1]
connect_bd_net [get_bd_pins M65_Core_0/cart_game_oe_o] [get_bd_pins cart_game_io_reg/Op2] [get_bd_pins cart_game_oe_n_o_i/Op1]
connect_bd_net [get_bd_pins M65_Core_0/cart_io1_o] [get_bd_pins cart_io1_io_reg/Op1]
connect_bd_net [get_bd_pins M65_Core_0/cart_io2_o] [get_bd_pins cart_io2_io_reg/Op1]
connect_bd_net [get_bd_pins M65_Core_0/cart_irq_o] [get_bd_pins cart_irq_io_reg/Op1]
connect_bd_net [get_bd_pins M65_Core_0/cart_irq_oe_o] [get_bd_pins cart_irq_io_reg/Op2] [get_bd_pins cart_irq_oe_n_o_i/Op1]
connect_bd_net [get_bd_pins M65_Core_0/cart_nmi_o] [get_bd_pins cart_nmi_io_reg/Op1]
connect_bd_net [get_bd_pins M65_Core_0/cart_nmi_oe_o] [get_bd_pins cart_nmi_io_reg/Op2] [get_bd_ports cart_nmi_oe_n_o]
connect_bd_net [get_bd_pins M65_Core_0/cart_phi2_o] [get_bd_ports cart_phi2_o]
connect_bd_net [get_bd_pins M65_Core_0/cart_reset_o] [get_bd_pins cart_reset_io_reg/Op1]
connect_bd_net [get_bd_pins M65_Core_0/cart_reset_oe_o] [get_bd_pins cart_reset_io_reg/Op2] [get_bd_ports cart_reset_oe_n_o]
connect_bd_net [get_bd_pins M65_Core_0/cart_romh_o] [get_bd_pins cart_romh_io_reg/Op1]
connect_bd_net [get_bd_pins M65_Core_0/cart_romh_oe_o] [get_bd_pins cart_romh_io_reg/Op2] [get_bd_ports cart_romh_oe_n_o]
connect_bd_net [get_bd_pins M65_Core_0/cart_roml_o] [get_bd_pins cart_roml_io_reg/Op1]
connect_bd_net [get_bd_pins M65_Core_0/cart_roml_oe_o] [get_bd_pins cart_roml_io_reg/Op2] [get_bd_ports cart_roml_oe_n_o]
connect_bd_net [get_bd_pins M65_Core_0/cart_rw_o] [get_bd_pins cart_rw_io_reg/Op1]
connect_bd_net [get_bd_pins M65_Core_0/hr_core_address_o] [get_bd_pins M65_Framework_0/hr_core_address_i]
connect_bd_net [get_bd_pins M65_Core_0/hr_core_burstcount_o] [get_bd_pins M65_Framework_0/hr_core_burstcount_i]
connect_bd_net [get_bd_pins M65_Core_0/hr_core_byteenable_o] [get_bd_pins M65_Framework_0/hr_core_byteenable_i]
connect_bd_net [get_bd_pins M65_Core_0/hr_core_read_o] [get_bd_pins M65_Framework_0/hr_core_read_i]
connect_bd_net [get_bd_pins M65_Core_0/hr_core_write_o] [get_bd_pins M65_Framework_0/hr_core_write_i]
connect_bd_net [get_bd_pins M65_Core_0/hr_core_writedata_o] [get_bd_pins M65_Framework_0/hr_core_writedata_i]
connect_bd_net [get_bd_pins M65_Core_0/iec_atn_n_o] [get_bd_ports iec_atn_n_o]
connect_bd_net [get_bd_pins M65_Core_0/iec_clk_en_o] [get_bd_pins util_vector_logic_0/Op1]
connect_bd_net [get_bd_pins M65_Core_0/iec_clk_n_o] [get_bd_ports iec_clk_n_o]
connect_bd_net [get_bd_pins M65_Core_0/iec_data_en_o] [get_bd_pins iec_data_en_n_o_reg/Op1]
connect_bd_net [get_bd_pins M65_Core_0/iec_data_n_o] [get_bd_ports iec_data_n_o]
connect_bd_net [get_bd_pins M65_Core_0/iec_reset_n_o] [get_bd_ports iec_reset_n_o]
connect_bd_net [get_bd_pins M65_Core_0/iec_srq_en_o] [get_bd_pins iec_srq_en_n_o_reg/Op1]
connect_bd_net [get_bd_pins M65_Core_0/iec_srq_n_o] [get_bd_ports iec_srq_n_o]
connect_bd_net [get_bd_pins M65_Core_0/main_audio_left_o] [get_bd_pins M65_Framework_0/main_audio_l_i]
connect_bd_net [get_bd_pins M65_Core_0/main_audio_right_o] [get_bd_pins M65_Framework_0/main_audio_r_i]
connect_bd_net [get_bd_pins M65_Core_0/main_clk_o] [get_bd_pins M65_Framework_0/main_clk_i]
connect_bd_net [get_bd_pins M65_Core_0/main_drive_led_col_o] [get_bd_pins M65_Framework_0/main_drive_led_col_i]
connect_bd_net [get_bd_pins M65_Core_0/main_drive_led_o] [get_bd_pins M65_Framework_0/main_drive_led_i]
connect_bd_net [get_bd_pins M65_Core_0/main_joy_1_down_n_o] [get_bd_pins M65_Framework_0/main_joy1_down_n_i]
connect_bd_net [get_bd_pins M65_Core_0/main_joy_1_fire_n_o] [get_bd_pins M65_Framework_0/main_joy1_fire_n_i]
connect_bd_net [get_bd_pins M65_Core_0/main_joy_1_left_n_o] [get_bd_pins M65_Framework_0/main_joy1_left_n_i]
connect_bd_net [get_bd_pins M65_Core_0/main_joy_1_right_n_o] [get_bd_pins M65_Framework_0/main_joy1_right_n_i]
connect_bd_net [get_bd_pins M65_Core_0/main_joy_1_up_n_o] [get_bd_pins M65_Framework_0/main_joy1_up_n_i]
connect_bd_net [get_bd_pins M65_Core_0/main_joy_2_down_n_o] [get_bd_pins M65_Framework_0/main_joy2_down_n_i]
connect_bd_net [get_bd_pins M65_Core_0/main_joy_2_fire_n_o] [get_bd_pins M65_Framework_0/main_joy2_fire_n_i]
connect_bd_net [get_bd_pins M65_Core_0/main_joy_2_left_n_o] [get_bd_pins M65_Framework_0/main_joy2_left_n_i]
connect_bd_net [get_bd_pins M65_Core_0/main_joy_2_right_n_o] [get_bd_pins M65_Framework_0/main_joy2_right_n_i]
connect_bd_net [get_bd_pins M65_Core_0/main_joy_2_up_n_o] [get_bd_pins M65_Framework_0/main_joy2_up_n_i]
connect_bd_net [get_bd_pins M65_Core_0/main_power_led_col_o] [get_bd_pins M65_Framework_0/main_power_led_col_i]
connect_bd_net [get_bd_pins M65_Core_0/main_power_led_o] [get_bd_pins M65_Framework_0/main_power_led_i]
connect_bd_net [get_bd_pins M65_Core_0/main_rst_o] [get_bd_pins main_reset_m2m_i/Op2] [get_bd_pins M65_Framework_0/main_rst_i]
connect_bd_net [get_bd_pins M65_Core_0/qnice_ascal_mode_o] [get_bd_pins M65_Framework_0/qnice_ascal_mode_i]
connect_bd_net [get_bd_pins M65_Core_0/qnice_ascal_polyphase_o] [get_bd_pins M65_Framework_0/qnice_ascal_polyphase_i]
connect_bd_net [get_bd_pins M65_Core_0/qnice_ascal_triplebuf_o] [get_bd_pins M65_Framework_0/qnice_ascal_triplebuf_i]
connect_bd_net [get_bd_pins M65_Core_0/qnice_audio_filter_o] [get_bd_pins M65_Framework_0/qnice_audio_filter_i]
connect_bd_net [get_bd_pins M65_Core_0/qnice_audio_mute_o] [get_bd_pins M65_Framework_0/qnice_audio_mute_i]
connect_bd_net [get_bd_pins M65_Core_0/qnice_csync_o] [get_bd_pins M65_Framework_0/qnice_csync_i]
connect_bd_net [get_bd_pins M65_Core_0/qnice_dev_data_o] [get_bd_pins M65_Framework_0/qnice_ramrom_data_in_i]
connect_bd_net [get_bd_pins M65_Core_0/qnice_dev_wait_o] [get_bd_pins M65_Framework_0/qnice_ramrom_wait_i]
connect_bd_net [get_bd_pins M65_Core_0/qnice_dvi_o] [get_bd_pins M65_Framework_0/qnice_dvi_i]
connect_bd_net [get_bd_pins M65_Core_0/qnice_flip_joyports_o] [get_bd_pins M65_Framework_0/qnice_flip_joyports_i]
connect_bd_net [get_bd_pins M65_Core_0/qnice_osm_cfg_scaling_o] [get_bd_pins M65_Framework_0/qnice_osm_cfg_scaling_i]
connect_bd_net [get_bd_pins M65_Core_0/qnice_retro15kHz_o] [get_bd_pins M65_Framework_0/qnice_retro15kHz_i]
connect_bd_net [get_bd_pins M65_Core_0/qnice_scandoubler_o] [get_bd_pins M65_Framework_0/qnice_scandoubler_i]
connect_bd_net [get_bd_pins M65_Core_0/qnice_video_mode_o] [get_bd_pins M65_Framework_0/qnice_video_mode_i]
connect_bd_net [get_bd_pins M65_Core_0/qnice_zoom_crop_o] [get_bd_pins M65_Framework_0/qnice_zoom_crop_i]
connect_bd_net [get_bd_pins M65_Core_0/video_blue_o] [get_bd_pins M65_Framework_0/video_blue_i]
connect_bd_net [get_bd_pins M65_Core_0/video_ce_o] [get_bd_pins M65_Framework_0/video_ce_i]
connect_bd_net [get_bd_pins M65_Core_0/video_ce_ovl_o] [get_bd_pins M65_Framework_0/video_ce_ovl_i]
connect_bd_net [get_bd_pins M65_Core_0/video_clk_o] [get_bd_pins M65_Framework_0/video_clk_i]
connect_bd_net [get_bd_pins M65_Core_0/video_green_o] [get_bd_pins M65_Framework_0/video_green_i]
connect_bd_net [get_bd_pins M65_Core_0/video_hblank_o] [get_bd_pins M65_Framework_0/video_hblank_i]
connect_bd_net [get_bd_pins M65_Core_0/video_hs_o] [get_bd_pins M65_Framework_0/video_hs_i]
connect_bd_net [get_bd_pins M65_Core_0/video_red_o] [get_bd_pins M65_Framework_0/video_red_i]
connect_bd_net [get_bd_pins M65_Core_0/video_rst_o] [get_bd_pins M65_Framework_0/video_rst_i]
connect_bd_net [get_bd_pins M65_Core_0/video_vblank_o] [get_bd_pins M65_Framework_0/video_vblank_i]
connect_bd_net [get_bd_pins M65_Core_0/video_vs_o] [get_bd_pins M65_Framework_0/video_vs_i]
connect_bd_net [get_bd_pins M65_Framework_0/audio_clk_o] [get_bd_pins audio_0/audio_clk_i]
connect_bd_net [get_bd_pins M65_Framework_0/audio_left_o] [get_bd_pins audio_0/audio_left_i]
connect_bd_net [get_bd_pins M65_Framework_0/audio_reset_o] [get_bd_pins audio_0/audio_reset_i]
connect_bd_net [get_bd_pins M65_Framework_0/audio_right_o] [get_bd_pins audio_0/audio_right_i]
connect_bd_net [get_bd_pins M65_Framework_0/hr_clk_o] [get_bd_pins M65_Core_0/hr_clk_i]
connect_bd_net [get_bd_pins M65_Framework_0/hr_clk_p_o] [get_bd_ports hr_clk_p_o]
connect_bd_net [get_bd_pins M65_Framework_0/hr_core_readdata_o] [get_bd_pins M65_Core_0/hr_core_readdata_i]
connect_bd_net [get_bd_pins M65_Framework_0/hr_core_readdatavalid_o] [get_bd_pins M65_Core_0/hr_core_readdatavalid_i]
connect_bd_net [get_bd_pins M65_Framework_0/hr_core_waitrequest_o] [get_bd_pins M65_Core_0/hr_core_waitrequest_i]
connect_bd_net [get_bd_pins M65_Framework_0/hr_cs0_o] [get_bd_ports hr_cs0_o]
connect_bd_net [get_bd_pins M65_Framework_0/hr_high_o] [get_bd_pins M65_Core_0/hr_high_i]
connect_bd_net [get_bd_pins M65_Framework_0/hr_low_o] [get_bd_pins M65_Core_0/hr_low_i]
connect_bd_net [get_bd_pins M65_Framework_0/hr_reset_o] [get_bd_ports hr_reset_o]
connect_bd_net [get_bd_pins M65_Framework_0/hr_rst_o] [get_bd_pins M65_Core_0/hr_rst_i]
connect_bd_net [get_bd_pins M65_Framework_0/joy_1_down_n_o] [get_bd_ports fa_down_n_o]
connect_bd_net [get_bd_pins M65_Framework_0/joy_1_fire_n_o] [get_bd_ports fa_fire_n_o]
connect_bd_net [get_bd_pins M65_Framework_0/joy_1_left_n_o] [get_bd_ports fa_left_n_o]
connect_bd_net [get_bd_pins M65_Framework_0/joy_1_right_n_o] [get_bd_ports fa_right_n_o]
connect_bd_net [get_bd_pins M65_Framework_0/joy_1_up_n_o] [get_bd_ports fa_up_n_o]
connect_bd_net [get_bd_pins M65_Framework_0/joy_2_down_n_o] [get_bd_ports fb_down_n_o]
connect_bd_net [get_bd_pins M65_Framework_0/joy_2_fire_n_o] [get_bd_ports fb_fire_n_o]
connect_bd_net [get_bd_pins M65_Framework_0/joy_2_left_n_o] [get_bd_ports fb_left_n_o]
connect_bd_net [get_bd_pins M65_Framework_0/joy_2_right_n_o] [get_bd_ports fb_right_n_o]
connect_bd_net [get_bd_pins M65_Framework_0/joy_2_up_n_o] [get_bd_ports fb_up_n_o]
connect_bd_net [get_bd_pins M65_Framework_0/kb_io0_o] [get_bd_ports kb_io0_o]
connect_bd_net [get_bd_pins M65_Framework_0/kb_io1_o] [get_bd_ports kb_io1_o]
connect_bd_net [get_bd_pins M65_Framework_0/main_joy1_down_n_o] [get_bd_pins M65_Core_0/main_joy_1_down_n_i]
connect_bd_net [get_bd_pins M65_Framework_0/main_joy1_fire_n_o] [get_bd_pins M65_Core_0/main_joy_1_fire_n_i]
connect_bd_net [get_bd_pins M65_Framework_0/main_joy1_left_n_o] [get_bd_pins M65_Core_0/main_joy_1_left_n_i]
connect_bd_net [get_bd_pins M65_Framework_0/main_joy1_right_n_o] [get_bd_pins M65_Core_0/main_joy_1_right_n_i]
connect_bd_net [get_bd_pins M65_Framework_0/main_joy1_up_n_o] [get_bd_pins M65_Core_0/main_joy_1_up_n_i]
connect_bd_net [get_bd_pins M65_Framework_0/main_joy2_down_n_o] [get_bd_pins M65_Core_0/main_joy_2_down_n_i]
connect_bd_net [get_bd_pins M65_Framework_0/main_joy2_fire_n_o] [get_bd_pins M65_Core_0/main_joy_2_fire_n_i]
connect_bd_net [get_bd_pins M65_Framework_0/main_joy2_left_n_o] [get_bd_pins M65_Core_0/main_joy_2_left_n_i]
connect_bd_net [get_bd_pins M65_Framework_0/main_joy2_right_n_o] [get_bd_pins M65_Core_0/main_joy_2_right_n_i]
connect_bd_net [get_bd_pins M65_Framework_0/main_joy2_up_n_o] [get_bd_pins M65_Core_0/main_joy_2_up_n_i]
connect_bd_net [get_bd_pins M65_Framework_0/main_key_num_o] [get_bd_pins M65_Core_0/main_kb_key_num_i]
connect_bd_net [get_bd_pins M65_Framework_0/main_key_pressed_n_o] [get_bd_pins M65_Core_0/main_kb_key_pressed_n_i]
connect_bd_net [get_bd_pins M65_Framework_0/main_osm_control_m_o] [get_bd_pins M65_Core_0/main_osm_control_i]
connect_bd_net [get_bd_pins M65_Framework_0/main_pot1_x_o] [get_bd_pins M65_Core_0/main_pot1_x_i]
connect_bd_net [get_bd_pins M65_Framework_0/main_pot1_y_o] [get_bd_pins M65_Core_0/main_pot1_y_i]
connect_bd_net [get_bd_pins M65_Framework_0/main_pot2_x_o] [get_bd_pins M65_Core_0/main_pot2_x_i]
connect_bd_net [get_bd_pins M65_Framework_0/main_pot2_y_o] [get_bd_pins M65_Core_0/main_pot2_y_i]
connect_bd_net [get_bd_pins M65_Framework_0/main_qnice_gp_reg_o] [get_bd_pins M65_Core_0/main_qnice_gp_reg_i]
connect_bd_net [get_bd_pins M65_Framework_0/main_qnice_pause_o] [get_bd_pins M65_Core_0/main_pause_core_i]
connect_bd_net [get_bd_pins M65_Framework_0/main_qnice_reset_o] [get_bd_pins main_reset_core_i_reg/Op1] [get_bd_pins main_reset_m2m_i2/Op2]
connect_bd_net [get_bd_pins M65_Framework_0/main_reset_core_o] [get_bd_pins main_reset_core_i_reg/Op2]
connect_bd_net [get_bd_pins M65_Framework_0/main_reset_m2m_o] [get_bd_pins main_reset_m2m_i2/Op1]
connect_bd_net [get_bd_pins M65_Framework_0/main_rtc_o] [get_bd_pins M65_Core_0/main_rtc_i]
connect_bd_net [get_bd_pins M65_Framework_0/paddle_drain_o] [get_bd_ports paddle_drain_o]
connect_bd_net [get_bd_pins M65_Framework_0/qnice_clk_o] [get_bd_pins M65_Core_0/qnice_clk_i]
connect_bd_net [get_bd_pins M65_Framework_0/qnice_gp_reg_o] [get_bd_pins M65_Core_0/qnice_gp_reg_i]
connect_bd_net [get_bd_pins M65_Framework_0/qnice_osm_control_m_o] [get_bd_pins M65_Core_0/qnice_osm_control_i]
connect_bd_net [get_bd_pins M65_Framework_0/qnice_ramrom_addr_o] [get_bd_pins M65_Core_0/qnice_dev_addr_i]
connect_bd_net [get_bd_pins M65_Framework_0/qnice_ramrom_ce_o] [get_bd_pins M65_Core_0/qnice_dev_ce_i]
connect_bd_net [get_bd_pins M65_Framework_0/qnice_ramrom_data_out_o] [get_bd_pins M65_Core_0/qnice_dev_data_i]
connect_bd_net [get_bd_pins M65_Framework_0/qnice_ramrom_dev_o] [get_bd_pins M65_Core_0/qnice_dev_id_i]
connect_bd_net [get_bd_pins M65_Framework_0/qnice_ramrom_we_o] [get_bd_pins M65_Core_0/qnice_dev_we_i]
connect_bd_net [get_bd_pins M65_Framework_0/qnice_rst_o] [get_bd_pins M65_Core_0/qnice_rst_i]
connect_bd_net [get_bd_pins M65_Framework_0/sd2_clk_o] [get_bd_ports sd2_clk_o]
connect_bd_net [get_bd_pins M65_Framework_0/sd2_mosi_o] [get_bd_ports sd2_mosi_o]
connect_bd_net [get_bd_pins M65_Framework_0/sd2_reset_o] [get_bd_ports sd2_reset_o]
connect_bd_net [get_bd_pins M65_Framework_0/sd_clk_o] [get_bd_ports sd_clk_o]
connect_bd_net [get_bd_pins M65_Framework_0/sd_mosi_o] [get_bd_ports sd_mosi_o]
connect_bd_net [get_bd_pins M65_Framework_0/sd_reset_o] [get_bd_ports sd_reset_o]
connect_bd_net [get_bd_pins M65_Framework_0/tmds_clk_n_o] [get_bd_ports tmds_clk_n_o]
connect_bd_net [get_bd_pins M65_Framework_0/tmds_clk_p_o] [get_bd_ports tmds_clk_p_o]
connect_bd_net [get_bd_pins M65_Framework_0/tmds_data_n_o] [get_bd_ports tmds_data_n_o]
connect_bd_net [get_bd_pins M65_Framework_0/tmds_data_p_o] [get_bd_ports tmds_data_p_o]
connect_bd_net [get_bd_pins M65_Framework_0/uart_txd_o] [get_bd_ports uart_txd_o]
connect_bd_net [get_bd_pins M65_Framework_0/vdac_blank_n_o] [get_bd_ports vdac_blank_n_o]
connect_bd_net [get_bd_pins M65_Framework_0/vdac_clk_o] [get_bd_ports vdac_clk_o]
connect_bd_net [get_bd_pins M65_Framework_0/vdac_sync_n_o] [get_bd_ports vdac_sync_n_o]
connect_bd_net [get_bd_pins M65_Framework_0/vga_blue_o] [get_bd_ports vga_blue_o]
connect_bd_net [get_bd_pins M65_Framework_0/vga_green_o] [get_bd_ports vga_green_o]
connect_bd_net [get_bd_pins M65_Framework_0/vga_hs_o] [get_bd_ports vga_hs_o]
connect_bd_net [get_bd_pins M65_Framework_0/vga_red_o] [get_bd_ports vga_red_o]
connect_bd_net [get_bd_pins M65_Framework_0/vga_vs_o] [get_bd_ports vga_vs_o]
connect_bd_net [get_bd_ports cart_a_io] [get_bd_pins cart_a_io/cart_a_io]
connect_bd_net [get_bd_ports cart_ba_io] [get_bd_pins cart_ba_io/cart_ba_io]
connect_bd_net [get_bd_ports cart_exrom_io] [get_bd_pins cart_exrom_io/cart_exrom_io]
connect_bd_net [get_bd_ports cart_game_io] [get_bd_pins cart_game_io/cart_game_io]
connect_bd_net [get_bd_ports cart_io1_io] [get_bd_pins cart_io1_io/cart_io1_io]
connect_bd_net [get_bd_ports cart_io2_io] [get_bd_pins cart_io2_io/cart_io2_io]
connect_bd_net [get_bd_ports cart_irq_io] [get_bd_pins cart_irq_io/cart_irq_io]
connect_bd_net [get_bd_ports cart_nmi_io] [get_bd_pins cart_nmi_io/cart_nmi_io]
connect_bd_net [get_bd_ports cart_reset_io] [get_bd_pins cart_reset_io/cart_reset_io]
connect_bd_net [get_bd_ports cart_romh_io] [get_bd_pins cart_romh_io/cart_romh_io]
connect_bd_net [get_bd_ports cart_roml_io] [get_bd_pins cart_roml_io/cart_roml_io]
connect_bd_net [get_bd_ports cart_rw_io] [get_bd_pins cart_rw_io/cart_rw_io]
connect_bd_net [get_bd_ports cart_d_io] [get_bd_pins cart_d_io/cart_d_io]
connect_bd_net [get_bd_ports audio_scl_io] [get_bd_pins M65_Framework_0/audio_scl_io]
connect_bd_net [get_bd_ports audio_sda_io] [get_bd_pins M65_Framework_0/audio_sda_io]
connect_bd_net [get_bd_ports fpga_scl_io] [get_bd_pins M65_Framework_0/fpga_scl_io]
connect_bd_net [get_bd_ports fpga_sda_io] [get_bd_pins M65_Framework_0/fpga_sda_io]
connect_bd_net [get_bd_ports grove_scl_io] [get_bd_pins M65_Framework_0/grove_scl_io]
connect_bd_net [get_bd_ports grove_sda_io] [get_bd_pins M65_Framework_0/grove_sda_io]
connect_bd_net [get_bd_ports hdmi_scl_io] [get_bd_pins M65_Framework_0/hdmi_scl_io]
connect_bd_net [get_bd_ports hdmi_sda_io] [get_bd_pins M65_Framework_0/hdmi_sda_io]
connect_bd_net [get_bd_ports hr_d_io] [get_bd_pins M65_Framework_0/hr_d_io]
connect_bd_net [get_bd_ports hr_rwds_io] [get_bd_pins M65_Framework_0/hr_rwds_io]
connect_bd_net [get_bd_ports i2c_scl_io] [get_bd_pins M65_Framework_0/i2c_scl_io]
connect_bd_net [get_bd_ports i2c_sda_io] [get_bd_pins M65_Framework_0/i2c_sda_io]
connect_bd_net [get_bd_ports vga_scl_io] [get_bd_pins M65_Framework_0/vga_scl_io]
connect_bd_net [get_bd_ports vga_sda_io] [get_bd_pins M65_Framework_0/vga_sda_io]
connect_bd_net [get_bd_pins audio_0/audio_bick_o] [get_bd_ports audio_bick_o]
connect_bd_net [get_bd_pins audio_0/audio_lrclk_o] [get_bd_ports audio_lrclk_o]
connect_bd_net [get_bd_pins audio_0/audio_mclk_o] [get_bd_ports audio_mclk_o]
connect_bd_net [get_bd_pins audio_0/audio_pdn_n_o] [get_bd_ports audio_pdn_n_o]
connect_bd_net [get_bd_pins audio_0/audio_sdti_o] [get_bd_ports audio_sdti_o]
connect_bd_net -net cart_a_io_reg_1 [get_bd_pins cart_a_io_reg/Res] [get_bd_pins cart_a_io/cart_a_io_reg] [get_bd_pins M65_Core_0/cart_a_i]
connect_bd_net -net cart_ba_i_1 [get_bd_pins cart_ba_io_reg/Res] [get_bd_pins cart_ba_io/cart_ba_i] [get_bd_pins M65_Core_0/cart_ba_i]
connect_bd_net [get_bd_pins cart_ctrl_en_o_i/Res] [get_bd_ports cart_addr_en_o] [get_bd_ports cart_ctrl_en_o] [get_bd_ports cart_data_en_o]
connect_bd_net [get_bd_pins cart_d_io_reg/Res] [get_bd_pins cart_d_io/cart_d_ioi] [get_bd_pins M65_Core_0/cart_d_i]
connect_bd_net [get_bd_ports cart_dma_i] [get_bd_pins M65_Core_0/cart_dma_i]
connect_bd_net -net cart_exrom_i_1 [get_bd_pins cart_exrom_io_reg/Res] [get_bd_pins cart_exrom_io/cart_exrom_i] [get_bd_pins M65_Core_0/cart_exrom_i]
connect_bd_net [get_bd_pins cart_exrom_oe_n_o_i/Res] [get_bd_ports cart_exrom_oe_n_o]
connect_bd_net [get_bd_pins cart_game_io_reg/Res] [get_bd_pins cart_game_io/cart_game_i] [get_bd_pins M65_Core_0/cart_game_i]
connect_bd_net [get_bd_pins cart_game_oe_n_o_i/Res] [get_bd_ports cart_game_oe_n_o]
connect_bd_net [get_bd_pins cart_io1_io_reg/Res] [get_bd_pins cart_io1_io/cart_io1_ioi] [get_bd_pins M65_Core_0/cart_io1_i]
connect_bd_net [get_bd_pins cart_io2_io_reg/Res] [get_bd_pins cart_io2_io/cart_io2_ioi] [get_bd_pins M65_Core_0/cart_io2_i]
connect_bd_net [get_bd_pins cart_irq_io_reg/Res] [get_bd_pins cart_irq_io/cart_irq_ioi] [get_bd_pins M65_Core_0/cart_irq_i]
connect_bd_net [get_bd_pins cart_irq_oe_n_o_i/Res] [get_bd_ports cart_irq_oe_n_o]
connect_bd_net [get_bd_pins cart_nmi_io_reg/Res] [get_bd_pins cart_nmi_io/cart_nmi_ioi] [get_bd_pins M65_Core_0/cart_nmi_i]
connect_bd_net [get_bd_pins cart_reset_io_reg/Res] [get_bd_pins cart_reset_io/cart_reset_ioi] [get_bd_pins M65_Core_0/cart_reset_i]
connect_bd_net [get_bd_pins cart_romh_io_reg/Res] [get_bd_pins cart_romh_io/cart_romh_ioi] [get_bd_pins M65_Core_0/cart_romh_i]
connect_bd_net [get_bd_pins cart_roml_io_reg/Res] [get_bd_pins cart_roml_io/cart_roml_ioi] [get_bd_pins M65_Core_0/cart_roml_i]
connect_bd_net [get_bd_pins cart_rw_io_reg/Res] [get_bd_pins cart_rw_io/cart_rw_ioi] [get_bd_pins M65_Core_0/cart_rw_i]
connect_bd_net [get_bd_ports clk_i] [get_bd_pins M65_Core_0/clk_i] [get_bd_pins M65_Framework_0/clk_i]
connect_bd_net [get_bd_ports fa_down_n_i] [get_bd_pins M65_Framework_0/joy_1_down_n_i]
connect_bd_net [get_bd_ports fa_fire_n_i] [get_bd_pins M65_Framework_0/joy_1_fire_n_i]
connect_bd_net [get_bd_ports fa_left_n_i] [get_bd_pins M65_Framework_0/joy_1_left_n_i]
connect_bd_net [get_bd_ports fa_right_n_i] [get_bd_pins M65_Framework_0/joy_1_right_n_i]
connect_bd_net [get_bd_ports fa_up_n_i] [get_bd_pins M65_Framework_0/joy_1_up_n_i]
connect_bd_net [get_bd_ports fb_down_n_i] [get_bd_pins M65_Framework_0/joy_2_down_n_i]
connect_bd_net [get_bd_ports fb_fire_n_i] [get_bd_pins M65_Framework_0/joy_2_fire_n_i]
connect_bd_net [get_bd_ports fb_left_n_i] [get_bd_pins M65_Framework_0/joy_2_left_n_i]
connect_bd_net [get_bd_ports fb_right_n_i] [get_bd_pins M65_Framework_0/joy_2_right_n_i]
connect_bd_net [get_bd_ports fb_up_n_i] [get_bd_pins M65_Framework_0/joy_2_up_n_i]
connect_bd_net [get_bd_ports iec_clk_n_i] [get_bd_pins M65_Core_0/iec_clk_n_i]
connect_bd_net [get_bd_pins iec_data_en_n_o_reg/Res] [get_bd_ports iec_data_en_n_o]
connect_bd_net [get_bd_ports iec_data_n_i] [get_bd_pins M65_Core_0/iec_data_n_i]
connect_bd_net [get_bd_pins iec_srq_en_n_o_reg/Res] [get_bd_ports iec_srq_en_n_o]
connect_bd_net [get_bd_ports iec_srq_n_i] [get_bd_pins M65_Core_0/iec_srq_n_i]
connect_bd_net [get_bd_ports kb_io2_i] [get_bd_pins M65_Framework_0/kb_io2_i]
connect_bd_net [get_bd_pins main_reset_core_i_reg/Res] [get_bd_pins M65_Core_0/main_reset_core_i]
connect_bd_net [get_bd_pins main_reset_m2m_i/Res] [get_bd_pins M65_Core_0/main_reset_m2m_i]
connect_bd_net [get_bd_ports paddle_i] [get_bd_pins M65_Framework_0/paddle_i]
connect_bd_net [get_bd_ports reset_button_i] [get_bd_pins reset_n_i0_i/Op1]
connect_bd_net [get_bd_pins reset_n_i0_i/Res] [get_bd_pins M65_Framework_0/reset_n_i]
connect_bd_net [get_bd_ports sd2_cd_i] [get_bd_pins M65_Framework_0/sd2_cd_i]
connect_bd_net [get_bd_ports sd2_miso_i] [get_bd_pins M65_Framework_0/sd2_miso_i]
connect_bd_net [get_bd_ports sd_cd_i] [get_bd_pins M65_Framework_0/sd_cd_i]
connect_bd_net [get_bd_ports sd_miso_i] [get_bd_pins M65_Framework_0/sd_miso_i]
connect_bd_net [get_bd_ports uart_rxd_i] [get_bd_pins M65_Framework_0/uart_rxd_i]
connect_bd_net [get_bd_pins util_vector_logic_0/Res] [get_bd_ports iec_clk_en_n_o]
connect_bd_net -net util_vector_logic_1_Res [get_bd_pins main_reset_m2m_i2/Res] [get_bd_pins main_reset_m2m_i/Op1]

validate_bd_design
save_bd_design
